# Altium schematic sheet Microcontroller.SchDoc
size A4; SheetNumber: 4; SheetTotal: 6
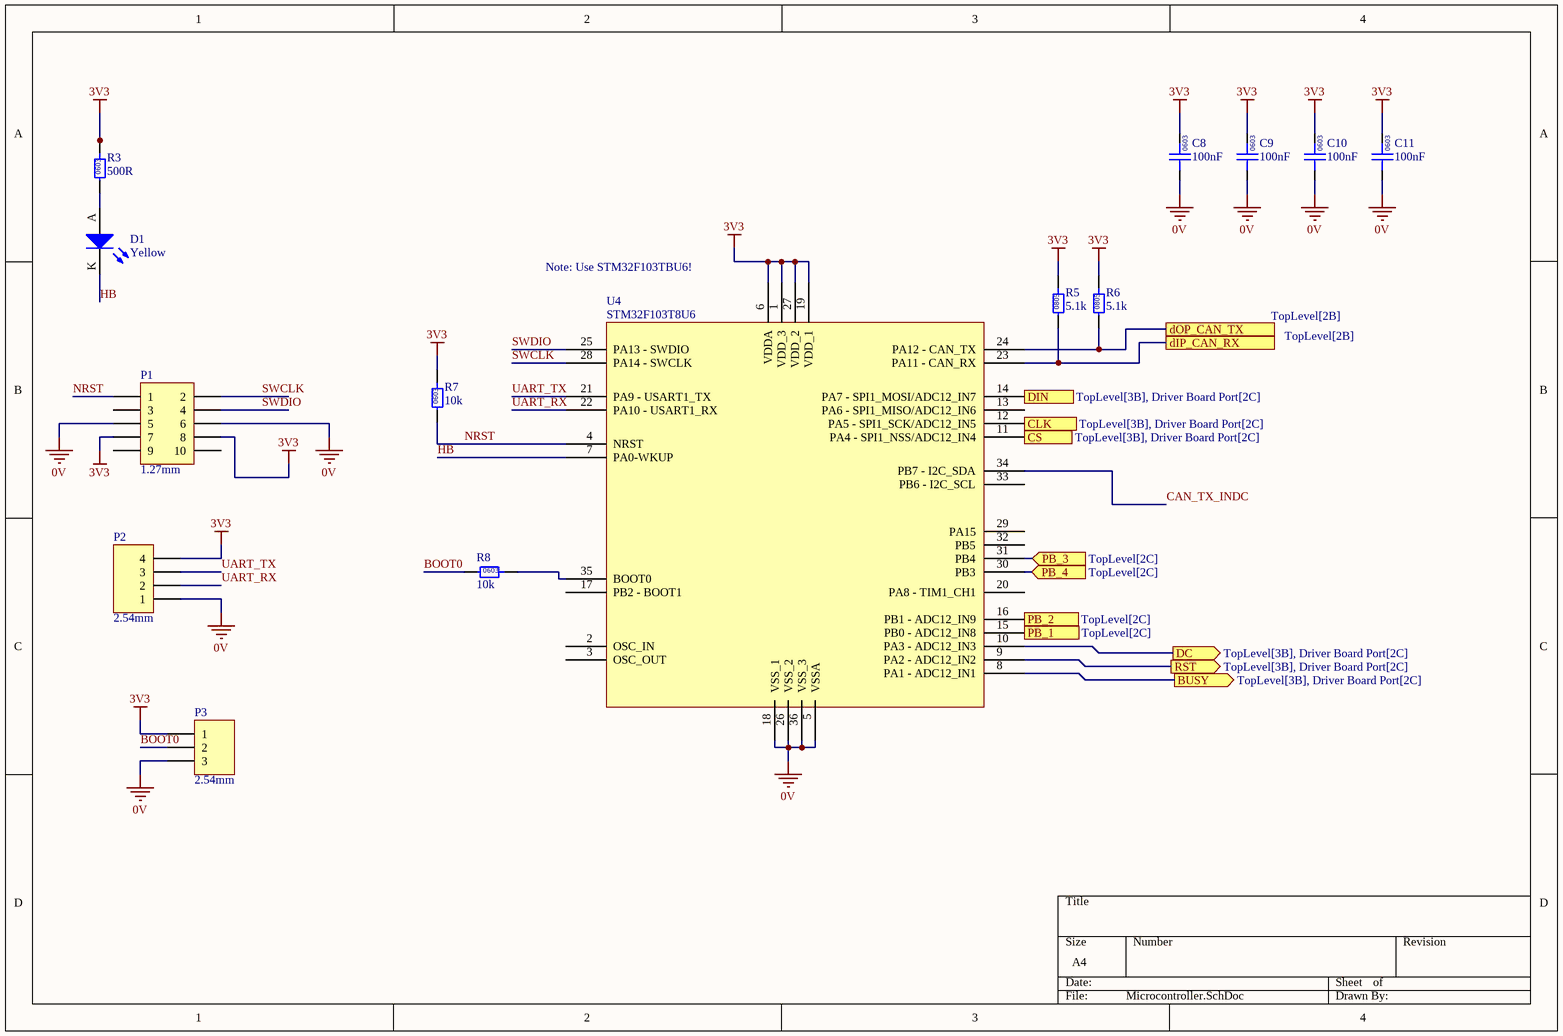
[diagram p0: Microcontroller.SchDoc]

## Parts
C8  100nF  [0603]
C9  100nF  [0603]
C10  100nF  [0603]
C11  100nF  [0603]
D1  Yellow  [0805 LED]
P1  1.27mm  [3221-10-0300-00]
P2  2.54mm  [TH 2.54mm Header 1x4]
P3  2.54mm  [TH 2.54mm Header 1x3]
R3  500R  [0603]
R5  5.1k  [0805]
R6  5.1k  [0805]
R7  10k  [0603]
R8  10k  [0603]
U4  STM32F103T8U6  [STM_QFN-36]

## Ports
BUSY (out, see TopLevel[3B], Driver Board Port[2C]), CLK (out, see TopLevel[3B], Driver Board Port[2C]), CS (out, see TopLevel[3B], Driver Board Port[2C]), DC (out, see TopLevel[3B], Driver Board Port[2C]), DIN (out, see TopLevel[3B], Driver Board Port[2C]), dIP_CAN_RX (see TopLevel[2B]), dOP_CAN_TX (see TopLevel[2B]), PB_1 (in, see TopLevel[2C]), PB_2 (in, see TopLevel[2C]), PB_3 (in, see TopLevel[2C]), PB_4 (in, see TopLevel[2C]), RST (out, see TopLevel[3B], Driver Board Port[2C])

## Nets
0V: C8.1 C9.1 C10.1 C11.1 P1.5 P1.6 P2.1 P3.3 U4.5(VSSA) U4.18(VSS_1) U4.26(VSS_2) U4.36(VSS_3)
3V3: C8.2 C9.2 C10.2 C11.2 P1.7 P1.8 P2.4 P3.1 R3.2 R5.2 R6.2 R7.2 U4.1(VDD_3) U4.6(VDDA) U4.19(VDD_1) U4.27(VDD_2)
BOOT0: P3.2 R8.1
BUSY: U4.8(PA1_-_ADC12_IN1) ; port BUSY
CAN_TX_INDC: U4.34(PB7_-_I2C_SDA)
CLK: U4.12(PA5_-_SPI1_SCK/ADC12_IN5) ; port CLK
CS: U4.11(PA4_-_SPI1_NSS/ADC12_IN4) ; port CS
DC: U4.10(PA3_-_ADC12_IN3) ; port DC
DIN: U4.14(PA7_-_SPI1_MOSI/ADC12_IN7) ; port DIN
dIP_CAN_RX: R5.1 U4.23(PA11_-_CAN_RX) ; port dIP_CAN_RX
dOP_CAN_TX: R6.1 U4.24(PA12_-_CAN_TX) ; port dOP_CAN_TX
HB: D1.K U4.7(PA0-WKUP)
NRST: P1.1 R7.1 U4.4(NRST)
PB_1: U4.15(PB0_-_ADC12_IN8) ; port PB_1
PB_2: U4.16(PB1_-_ADC12_IN9) ; port PB_2
PB_3: U4.31(PB4) ; port PB_3
PB_4: U4.30(PB3) ; port PB_4
RST: U4.9(PA2_-_ADC12_IN2) ; port RST
SWCLK: P1.2 U4.28(PA14_-_SWCLK)
SWDIO: P1.4 U4.25(PA13_-_SWDIO)
UART_RX: P2.2 U4.22(PA10_-_USART1_RX)
UART_TX: P2.3 U4.21(PA9_-_USART1_TX)
NetD1_A: D1.A R3.1
NetR8_2: R8.2 U4.35(BOOT0)

Not connected (* = marked no-connect by the designer): P1 3 9 10; U4 2(OSC_IN) 3(OSC_OUT) 13(PA6_-_SPI1_MISO/ADC12_IN6) 17(PB2_-_BOOT1_) 20(PA8_-_TIM1_CH1) 29(PA15) 32(PB5) 33(PB6_-_I2C_SCL)

## Notes on the sheet
- (near U4) Note: Use STM32F103TBU6!
- (in symbol GCM188L81H104KA57D) 0603
- (in symbol RC0603FR-0710KL) 0603
- (in symbol RC0805FR075K1L) 0805
- (in symbol RT0603BRD07500RL) 0603

## Library data of the parts
C8-C11 = GCM188L81H104KA57D: Manufacturer: muRata; Rated Voltage: 50V; Tolerance: ±10%; Material: MLCC; Temperature Rating: X8L; Part Number: GCM188L81H104KA57D; Value: 100nF; Digikey Part Number: 490-6049-1-ND
D1 = SML-211YTT86: Yellow LED Indication - Discrete 1.75V 0805 (2012 Metric); Manufacturer: ROHM Semiconductor; Part Number: SML-211YTT86; Colour: Yellow; Digikey Part Number: 511-1293-1-ND
P1 = SMD 1.27mm Header 2x5 (3221-10-0300-00): Positions: 10; Angle: 0; Flange: No; Contact: NA; Part Number: SMD 1.27mm Header 2x5 (3221-10-0300-00); Pitch: 1.27mm; Row Spacing: 1.27mm
P2 = TH 2.54mm Header 1x4: Positions: 4; Angle: 0; Flange: No; Contact: NA; Part Number: TH 2.54mm Header 1x4; Pitch: 2.54mm; Row Spacing: 2.54mm
P3 = TH 2.54mm Header 1x3: Positions: 3; Angle: 0; Flange: No; Contact: NA; Part Number: TH 2.54mm Header 1x3; Pitch: 2.54mm; Row Spacing: 2.54mm
R3 = RT0603BRD07500RL: Manufacturer: YAGEO; Tolerance: 0.01; Rated Power: 0.1W; Part Number: RT0603BRD07500RL; Value: 500R; Material: FR-07; Digikey Part Number: 13-RT0603BRD07500RL-ND
R5 R6 = RC0805FR075K1L: Manufacturer: YAGEO; Tolerance: 0.01; Rated Power: 0.125W; Part Number: RC0805FR075K1L; Value: 5.1k; Material: FR-07; Digikey Part Number: 311-5.10KCRCT-ND
R7 R8 = RC0603FR-0710KL: Manufacturer: YAGEO; Tolerance: 0.01; Rated Power: 0.1W; Part Number: RC0603FR-0710KL; Value: 10k; Digikey Part Number: 311-10.0KHRCT-ND; Material: FR-07
U4 = STM32F103T8U6: ARM® Cortex®-M3 STM32F1 Microcontroller IC 32-Bit 72MHz 64KB (64K x 8) FLASH QFN; Manufacturer: ST Microelectronics; Part Number: STM32F103T8U6; Digikey Part Number: STM32F103T8U6; Digikey Link: https://www.digikey.com/en/products/detail/stmicroelectronics/stm32f103t8u6/1852493